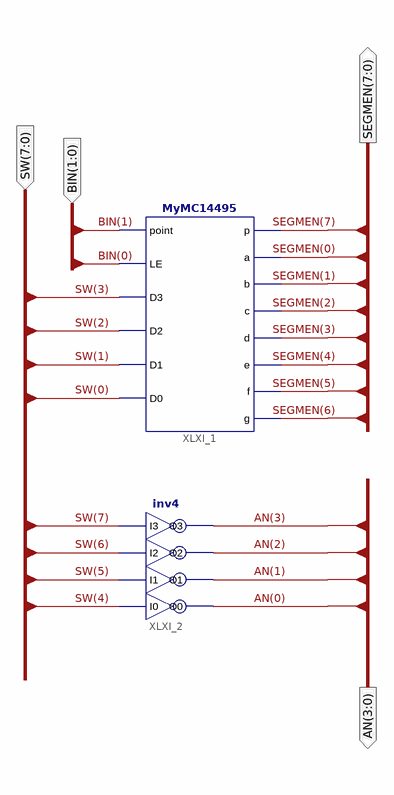
[diagram p0: schematic sheet 1]
// Xilinx ISE schematic DispNumber_sch.sch (kintex7) as structural Verilog: 2 symbols, 4 ports
module DispNumber_sch (
  input  [7:0] SW,
  input  [1:0] BIN,
  output [7:0] SEGMEN,
  output [3:0] AN
);

  MyMC14495 XLXI_1 (
    .point(BIN[1]), .LE(BIN[0]), .D3(SW[3]), .D2(SW[2]), .D1(SW[1]), .D0(SW[0]), .p(SEGMEN[7]),
    .a(SEGMEN[0]), .b(SEGMEN[1]), .c(SEGMEN[2]), .d(SEGMEN[3]), .e(SEGMEN[4]), .f(SEGMEN[5]), .g(SEGMEN[6]));
  inv4 XLXI_2 (.I0(SW[4]), .I1(SW[5]), .I2(SW[6]), .I3(SW[7]), .O0(AN[0]), .O1(AN[1]), .O2(AN[2]), .O3(AN[3]));
endmodule
